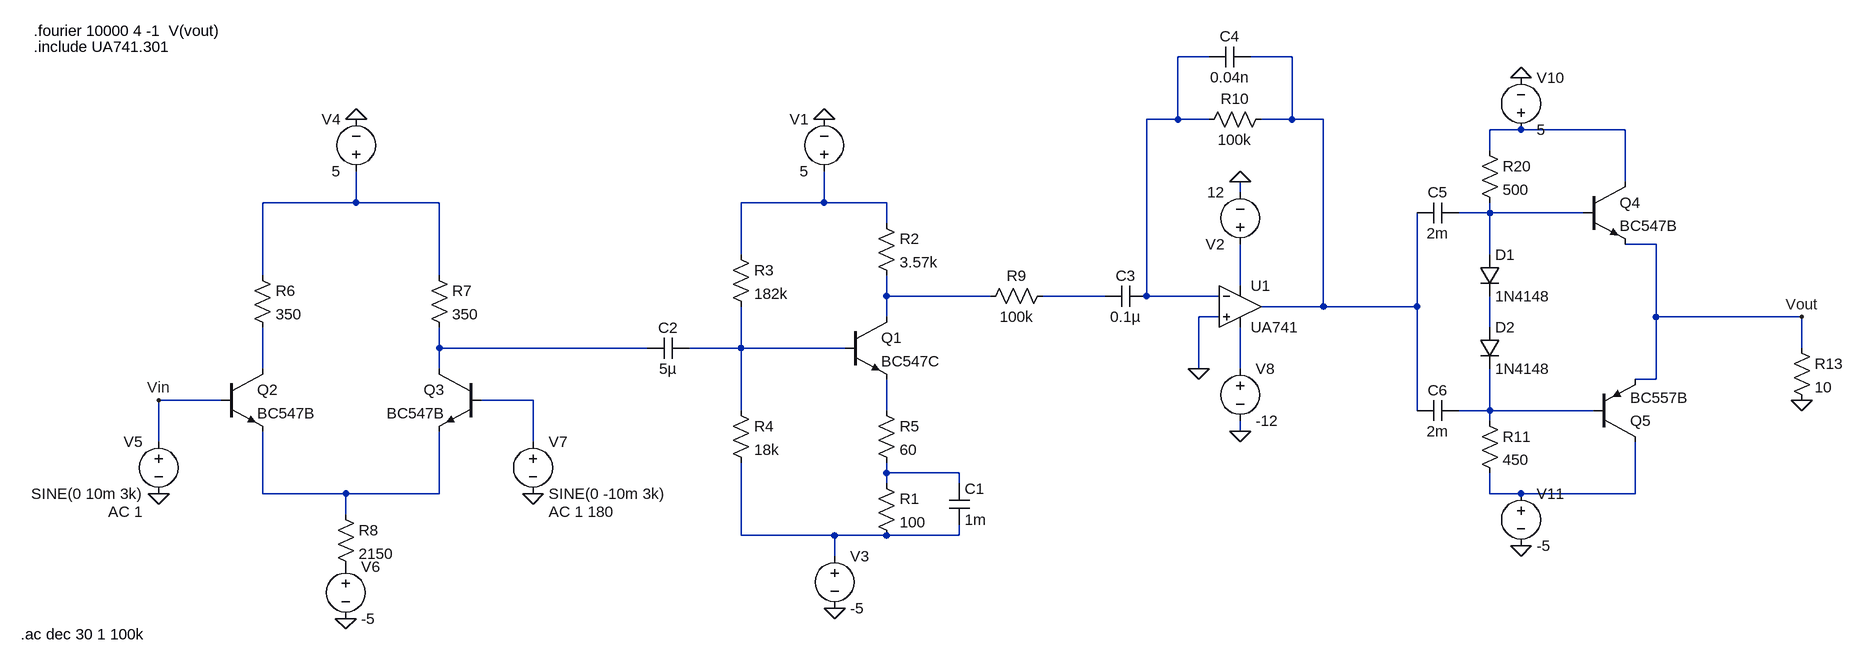
[diagram p0: schematic integrated_final_ckt.asc]
integrated_final_ckt.asc, the LTspice schematic file:
Version 4
SHEET 1 2388 696
WIRE 720 -336 672 -336
WIRE 848 -336 784 -336
WIRE 672 -240 672 -336
WIRE 672 -240 624 -240
WIRE 720 -240 672 -240
WIRE 848 -240 848 -336
WIRE 848 -240 800 -240
WIRE 896 -240 848 -240
WIRE 1200 -224 1152 -224
WIRE 1360 -224 1200 -224
WIRE 1152 -192 1152 -224
WIRE 1360 -144 1360 -224
WIRE 768 -128 768 -144
WIRE -592 -112 -592 -160
WIRE -592 -112 -736 -112
WIRE -464 -112 -592 -112
WIRE 128 -112 128 -160
WIRE 128 -112 0 -112
WIRE 224 -112 128 -112
WIRE 1152 -96 1152 -112
WIRE 1152 -96 1104 -96
WIRE 1296 -96 1152 -96
WIRE 224 -80 224 -112
WIRE 1408 -48 1360 -48
WIRE 0 -32 0 -112
WIRE 1152 -32 1152 -96
WIRE -736 0 -736 -112
WIRE -464 0 -464 -112
WIRE 768 16 768 -48
WIRE 224 32 224 0
WIRE 384 32 224 32
WIRE 560 32 464 32
WIRE 624 32 624 -240
WIRE 736 32 624 32
WIRE 896 48 896 -240
WIRE 896 48 800 48
WIRE 1040 48 1040 -96
WIRE 1040 48 896 48
WIRE 224 64 224 32
WIRE 736 64 704 64
WIRE 1408 64 1408 -48
WIRE 1632 64 1408 64
WIRE 1152 80 1152 32
WIRE -464 112 -464 80
WIRE -144 112 -464 112
WIRE 0 112 0 48
WIRE 0 112 -80 112
WIRE 160 112 0 112
WIRE 1632 112 1632 64
WIRE -736 144 -736 80
WIRE -464 144 -464 112
WIRE 704 144 704 64
WIRE 768 144 768 80
WIRE 1408 160 1408 64
WIRE 1408 160 1376 160
WIRE -800 192 -896 192
WIRE -320 192 -400 192
WIRE 0 208 0 112
WIRE 224 208 224 160
WIRE 1040 208 1040 48
WIRE 1152 208 1152 144
WIRE 1152 208 1104 208
WIRE 1312 208 1152 208
WIRE 1152 224 1152 208
WIRE 768 240 768 224
WIRE -896 256 -896 192
WIRE -320 256 -320 192
WIRE 224 304 224 288
WIRE 336 304 224 304
WIRE 224 320 224 304
WIRE 336 320 336 304
WIRE -736 336 -736 240
WIRE -608 336 -736 336
WIRE -464 336 -464 240
WIRE -464 336 -608 336
WIRE 1152 336 1152 304
WIRE 1200 336 1152 336
WIRE 1376 336 1376 256
WIRE 1376 336 1200 336
WIRE -608 368 -608 336
WIRE 0 400 0 288
WIRE 144 400 0 400
WIRE 224 400 144 400
WIRE 336 400 336 384
WIRE 336 400 224 400
WIRE 144 432 144 400
FLAG 128 -240 0
FLAG 144 512 0
FLAG -896 336 0
FLAG -592 -240 0
FLAG -608 528 0
FLAG -320 336 0
FLAG 768 -144 0
FLAG 768 240 0
FLAG 704 144 0
FLAG 1200 416 0
FLAG 1200 -304 0
FLAG 1632 192 0
FLAG 1632 64 Vout
FLAG -896 192 Vin
SYMBOL npn 160 64 R0
SYMATTR InstName Q1
SYMATTR Value BC547C
SYMBOL res 208 304 R0
SYMATTR InstName R1
SYMATTR Value 100
SYMBOL res 208 -96 R0
SYMATTR InstName R2
SYMATTR Value 3.57k
SYMBOL res -16 -48 R0
SYMATTR InstName R3
SYMATTR Value 182k
SYMBOL res -16 192 R0
SYMATTR InstName R4
SYMATTR Value 18k
SYMBOL voltage 128 -144 R180
WINDOW 0 24 96 Left 2
WINDOW 3 24 16 Left 2
WINDOW 123 0 0 Left 0
WINDOW 39 0 0 Left 0
SYMATTR InstName V1
SYMATTR Value 5
SYMBOL cap 320 320 R0
SYMATTR InstName C1
SYMATTR Value 1m
SYMBOL cap -80 96 R90
WINDOW 0 0 32 VBottom 2
WINDOW 3 32 32 VTop 2
SYMATTR InstName C2
SYMATTR Value 5µ
SYMBOL voltage 144 416 R0
WINDOW 123 0 0 Left 0
WINDOW 39 0 0 Left 0
SYMATTR InstName V3
SYMATTR Value -5
SYMBOL res 208 192 R0
SYMATTR InstName R5
SYMATTR Value 60
SYMBOL npn -800 144 R0
SYMATTR InstName Q2
SYMATTR Value BC547B
SYMBOL res -752 -16 R0
SYMATTR InstName R6
SYMATTR Value 350
SYMBOL res -480 -16 R0
SYMATTR InstName R7
SYMATTR Value 350
SYMBOL npn -400 144 M0
SYMATTR InstName Q3
SYMATTR Value BC547B
SYMBOL res -624 352 R0
SYMATTR InstName R8
SYMATTR Value 2150
SYMBOL voltage -592 -144 R180
WINDOW 0 24 96 Left 2
WINDOW 3 24 16 Left 2
WINDOW 123 0 0 Left 0
WINDOW 39 0 0 Left 0
SYMATTR InstName V4
SYMATTR Value 5
SYMBOL voltage -896 240 M0
WINDOW 123 24 124 Left 2
WINDOW 39 0 0 Left 0
SYMATTR Value2 AC 1
SYMATTR InstName V5
SYMATTR Value SINE(0 10m 3k)
SYMBOL voltage -608 432 R0
WINDOW 123 0 0 Left 0
WINDOW 39 0 0 Left 0
SYMATTR InstName V6
SYMATTR Value -5
SYMBOL voltage -320 240 R0
WINDOW 123 24 124 Left 2
WINDOW 39 0 0 Left 0
SYMATTR Value2 AC 1 180
SYMATTR InstName V7
SYMATTR Value SINE(0 -10m 3k)
SYMBOL voltage 768 -32 R180
WINDOW 123 0 0 Left 0
WINDOW 39 0 0 Left 0
SYMATTR InstName V2
SYMATTR Value 12
SYMBOL res 480 16 R90
WINDOW 0 0 56 VBottom 2
WINDOW 3 32 56 VTop 2
SYMATTR InstName R9
SYMATTR Value 100k
SYMBOL cap 624 16 R90
WINDOW 0 0 32 VBottom 2
WINDOW 3 32 32 VTop 2
SYMATTR InstName C3
SYMATTR Value 0.1µ
SYMBOL res 816 -256 R90
WINDOW 0 0 56 VBottom 2
WINDOW 3 32 56 VTop 2
SYMATTR InstName R10
SYMATTR Value 100k
SYMBOL cap 784 -352 R90
WINDOW 0 0 32 VBottom 2
WINDOW 3 32 32 VTop 2
SYMATTR InstName C4
SYMATTR Value 0.04n
SYMBOL OpAmps\\opamp2 768 -16 R0
SYMATTR InstName U1
SYMATTR Value UA741
SYMBOL diode 1136 -32 R0
SYMATTR InstName D1
SYMATTR Value 1N4148
SYMBOL diode 1136 80 R0
SYMATTR InstName D2
SYMATTR Value 1N4148
SYMBOL npn 1296 -144 R0
SYMATTR InstName Q4
SYMATTR Value BC547B
SYMBOL pnp 1312 256 M180
SYMATTR InstName Q5
SYMATTR Value BC557B
SYMBOL res 1136 208 R0
SYMATTR InstName R11
SYMATTR Value 450
SYMBOL res 1136 -208 R0
SYMATTR InstName R20
SYMATTR Value 500
SYMBOL voltage 1200 -208 M180
WINDOW 0 24 96 Left 2
WINDOW 3 24 16 Left 2
WINDOW 123 0 0 Left 0
WINDOW 39 0 0 Left 0
SYMATTR InstName V10
SYMATTR Value 5
SYMBOL voltage 1200 320 R0
WINDOW 123 0 0 Left 0
WINDOW 39 0 0 Left 0
SYMATTR InstName V11
SYMATTR Value -5
SYMBOL res 1616 96 R0
SYMATTR InstName R13
SYMATTR Value 10
SYMBOL cap 1104 -112 R90
WINDOW 0 0 32 VBottom 2
WINDOW 3 32 32 VTop 2
SYMATTR InstName C5
SYMATTR Value 2m
SYMBOL cap 1104 192 R90
WINDOW 0 0 32 VBottom 2
WINDOW 3 32 32 VTop 2
SYMATTR InstName C6
SYMATTR Value 2m
SYMBOL voltage 768 128 R0
WINDOW 123 0 0 Left 0
WINDOW 39 0 0 Left 0
SYMATTR InstName V8
SYMATTR Value -12
TEXT -1088 -376 Left 2 !.fourier 10000 4 -1  V(vout)
TEXT -1088 -352 Left 2 !.include UA741.301
TEXT -1108 552 Left 2 !.ac dec 30 1 100k

The netlist it stands for:
* integrated_final_ckt.asc
Q1 N008 N012 N016 0 BC547C
R1 N018 N021 100
R2 N005 N008 3.57k
R3 N005 N012 182k
R4 N012 N021 18k
V1 N005 0 5
C1 N018 N021 1m
C2 N012 N011 5µ
V3 N021 0 -5
R5 N016 N018 60
Q2 N013 Vin N019 0 BC547B
R6 N004 N013 350
R7 N004 N011 350
Q3 N011 N015 N019 0 BC547B
R8 N019 P001 2150
V4 N004 0 5
V5 Vin 0 SINE(0 10m 3k) AC 1
V6 P001 0 -5
V7 N015 0 SINE(0 -10m 3k) AC 1 180
V2 N007 0 12
R9 N009 N008 100k
C3 N001 N009 0.1µ
R10 N002 N001 100k
C4 N002 N001 0.04n
XU1 0 N001 N007 N014 N002 UA741  ; pins In+ In- V+ V- OUT
D1 N006 N010 1N4148
D2 N010 N017 1N4148
Q4 N003 N006 Vout 0 BC547B
Q5 N020 N017 Vout 0 BC557B
R11 N017 N020 450
R20 N003 N006 500
V10 N003 0 5
V11 N020 0 -5
R13 Vout 0 10
C5 N006 N002 2m
C6 N017 N002 2m
V8 N014 0 -12
.model D D
.lib standard.dio
.model NPN NPN
.model PNP PNP
.lib standard.bjt
.fourier 10000 4 -1  V(vout)
.include UA741.301
.ac dec 30 1 100k
.backanno
.end